# Altium schematic sheet MCU_GPIO.SchDoc: MCU Gpio
size A4; DocumentNumber: 5; SheetNumber: 5; SheetTotal: 8
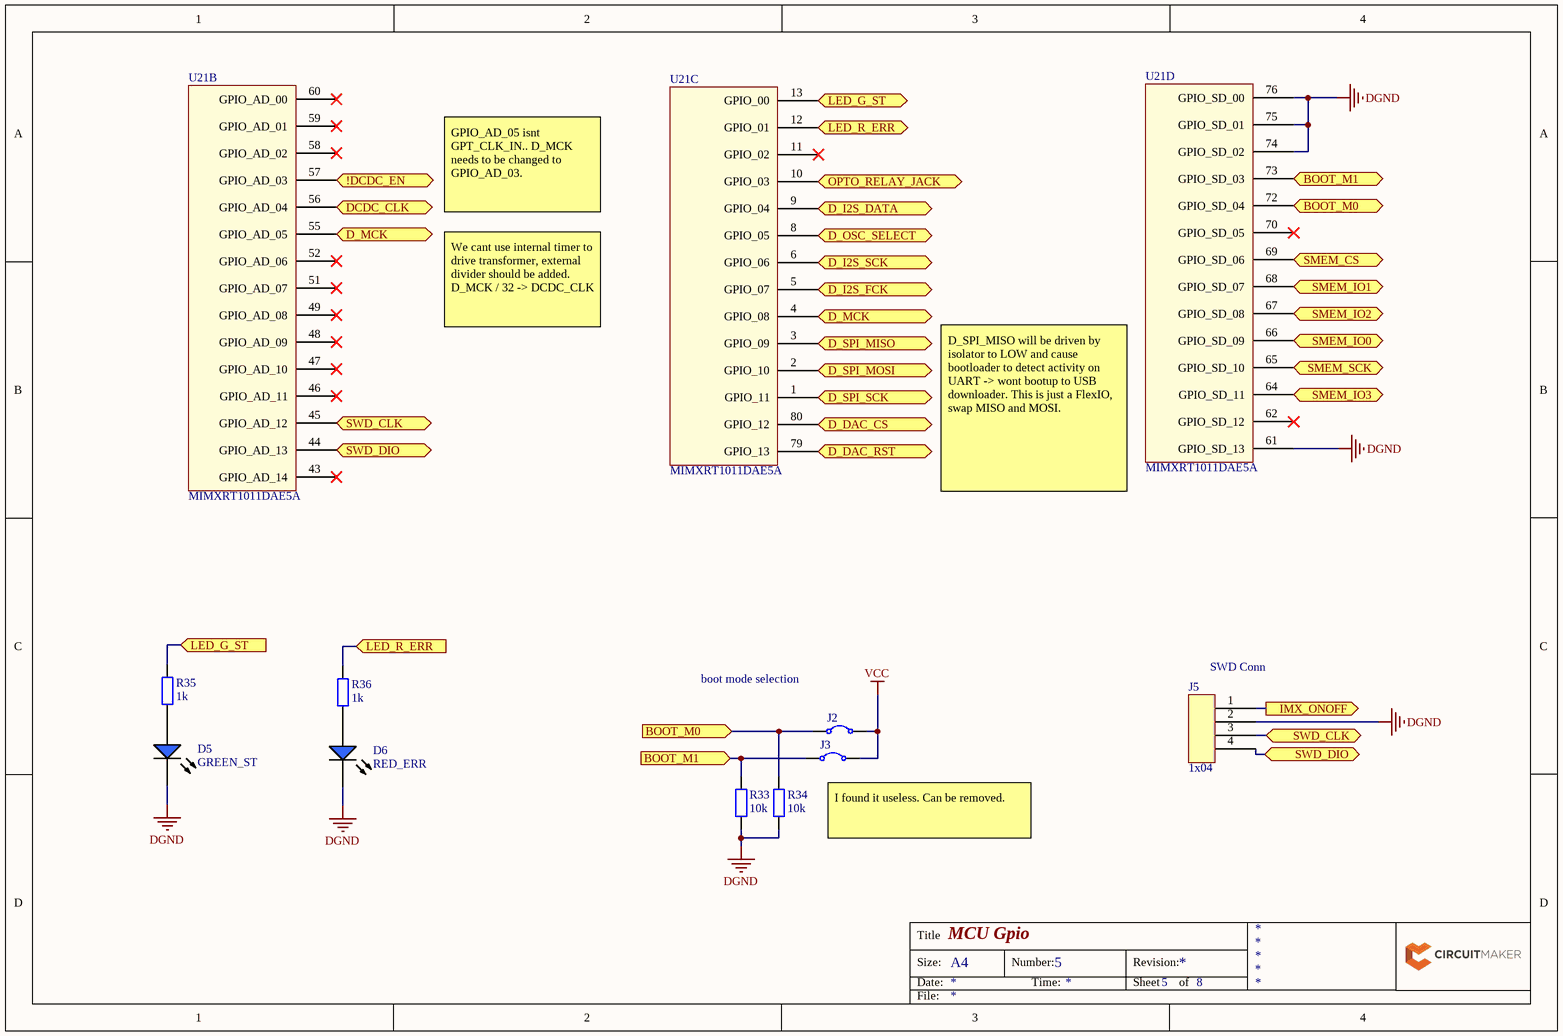
[diagram p0: MCU_GPIO.SchDoc]

## Parts
D5  GREEN_ST  [PCB-iuhwubou6tsv2qadu19r-1]
D6  RED_ERR  [PCB-iuhwubou6tsv2qadu19r-1]
J2  3M 923345-03-C  [PCB-ha706v9ghebje50nqhkf-1]  (value not drawn)
J3  3M 923345-03-C  [PCB-ha706v9ghebje50nqhkf-1]  (value not drawn)
J5  1x04  [PCB-w7fgx0p37qyww1etoafk-1]
R33  10k  [PCB-3d5y3t7f8drf35yjcj59-1]
R34  10k  [PCB-3d5y3t7f8drf35yjcj59-1]
R35  1k  [PCB-3d5y3t7f8drf35yjcj59-1]
R36  1k  [PCB-3d5y3t7f8drf35yjcj59-1]
U21  MIMXRT1011DAE5A  [PCB-9tw520wec8sfx58i85wg-1]  (parts B,C,D of 5)

## Ports
!DCDC_EN (out), BOOT_M0 (in), BOOT_M1 (in), D_DAC_CS (out), D_DAC_RST (out), D_I2S_DATA (out), D_I2S_FCK (out), D_I2S_SCK (out), D_MCK (in), D_OSC_SELECT (out), D_SPI_MISO (in), D_SPI_MOSI (out), D_SPI_SCK (out), DCDC_CLK (out), IMX_ONOFF (out), LED_G_ST (in), LED_G_ST (out), LED_R_ERR (in), LED_R_ERR (out), OPTO_RELAY_JACK (out), SMEM_CS, SMEM_IO0, SMEM_IO1, SMEM_IO2, SMEM_IO3, SMEM_SCK, SWD_CLK (bidir), SWD_DIO (bidir)

## Nets
DGND: D5.2(K) D6.2(K) J5.2 R33.2 R34.2 U21.61(GPIO_SD_13) U21.74(GPIO_SD_02) U21.75(GPIO_SD_01) U21.76(GPIO_SD_00)
VCC: J2.2 J3.2
!DCDC_EN: U21.57(GPIO_AD_03) ; port !DCDC_EN
BOOT_M0: J2.1 R34.1 U21.72(GPIO_SD_04) ; port BOOT_M0
BOOT_M1: J3.1 R33.1 U21.73(GPIO_SD_03) ; port BOOT_M1
D_DAC_CS: U21.80(GPIO_12) ; port D_DAC_CS
D_DAC_RST: U21.79(GPIO_13) ; port D_DAC_RST
D_I2S_DATA: U21.9(GPIO_04) ; port D_I2S_DATA
D_I2S_FCK: U21.5(GPIO_07) ; port D_I2S_FCK
D_I2S_SCK: U21.6(GPIO_06) ; port D_I2S_SCK
D_MCK: U21.4(GPIO_08) U21.55(GPIO_AD_05) ; port D_MCK
D_OSC_SELECT: U21.8(GPIO_05) ; port D_OSC_SELECT
D_SPI_MISO: U21.3(GPIO_09) ; port D_SPI_MISO
D_SPI_MOSI: U21.2(GPIO_10) ; port D_SPI_MOSI
D_SPI_SCK: U21.1(GPIO_11) ; port D_SPI_SCK
DCDC_CLK: U21.56(GPIO_AD_04) ; port DCDC_CLK
IMX_ONOFF: J5.1 ; port IMX_ONOFF
LED_G_ST: R35.1 U21.13(GPIO_00) ; port LED_G_ST
LED_R_ERR: R36.1 U21.12(GPIO_01) ; port LED_R_ERR
OPTO_RELAY_JACK: U21.10(GPIO_03) ; port OPTO_RELAY_JACK
SMEM_CS: U21.69(GPIO_SD_06) ; port SMEM_CS
SMEM_IO0: U21.66(GPIO_SD_09) ; port SMEM_IO0
SMEM_IO1: U21.68(GPIO_SD_07) ; port SMEM_IO1
SMEM_IO2: U21.67(GPIO_SD_08) ; port SMEM_IO2
SMEM_IO3: U21.64(GPIO_SD_11) ; port SMEM_IO3
SMEM_SCK: U21.65(GPIO_SD_10) ; port SMEM_SCK
SWD_CLK: J5.3 U21.45(GPIO_AD_12) ; port SWD_CLK
SWD_DIO: J5.4 U21.44(GPIO_AD_13) ; port SWD_DIO
NetD5_1: D5.1(A) R35.2
NetD6_1: D6.1(A) R36.2

Not connected (* = marked no-connect by the designer): U21 11(GPIO_02)* 43(GPIO_AD_14)* 46(GPIO_AD_11)* 47(GPIO_AD_10)* 48(GPIO_AD_09)* 49(GPIO_AD_08)* 51(GPIO_AD_07)* 52(GPIO_AD_06)* 58(GPIO_AD_02)* 59(GPIO_AD_01)* 60(GPIO_AD_00)* 62(GPIO_SD_12)* 70(GPIO_SD_05)*

## Notes on the sheet
- GPIO_AD_05 isnt GPT_CLK_IN.. D_MCK needs to be changed to GPIO_AD_03.
- We cant use internal timer to drive transformer, external divider should be added. D_MCK / 32 -> DCDC_CLK
- D_SPI_MISO will be driven by isolator to LOW and cause bootloader to detect activity on UART -> wont bootup to USB  downloader. This is just a FlexIO, swap MISO and MOSI.
- boot mode selection
- (near J5) SWD Conn
- (near J3) I found it useless. Can be removed.
- Title
- Size:
- Date:
- A4
- Number:
- Time:
- Revision:
- Sheet
- of
- File:

## Library data of the parts
D5 D6 = CMP-3013fb4020e1efd4-7: LED; Red; 1.2mcd; 3.2mmDia.; T-1; 7mA; 1.9V; 635nm; +/-25deg; GaAsP on GaP; 15V; Voltage Rating (DC): 1.90 V; Color: Blue; RoHS: Compliant; Packaging: Bulk; Operating Temperature: -40.0 °C (min); Size-Diameter: 3.20 mm
J2 J3 = CMP-s51b8wf5jcfui9wi7awt-5: SMD Jumper
J5 = CMP-4df18464dcf59236-4: Conn Unshrouded Header HDR 4 POS 2.54mm Solder ST Thru-Hole KK?? Bag; Manufacturer Part Number: 0022032041; RoHS: Compliant; OctopartID: 4df18464dcf59236; Octopart URL: http://octopart.com/0022032041-molex-10466402; Lifecycle Status: Not Listed by Manufacturer
R33-R36 = CMP-xcu3s4ikiffkkgbeyow5-1: Resistor 0603; CustomComponentID: xcu3s4ikiffkkgbeyow5
  R33 R34: LCSC Part #: C25804
  R35: LCSC Part #: C21190; LCSC Part #: C81598; LCSC Part #: C1546; LCSC Part #: C23265; LCSC Part #: C23345
  R36: LCSC Part #: C21190
U21 = MIMXRT1011DAE5A: i.MX RT1011: 3.3 V 500 MHz 1 Core SMT 32-Bit Microprocessor IC - LQFP-80; OctopartID: 6e97a1b3b0b6b150; Manufacturer Part Number: MIMXRT1011DAE5A; Lifecycle Status: Not Listed by Manufacturer